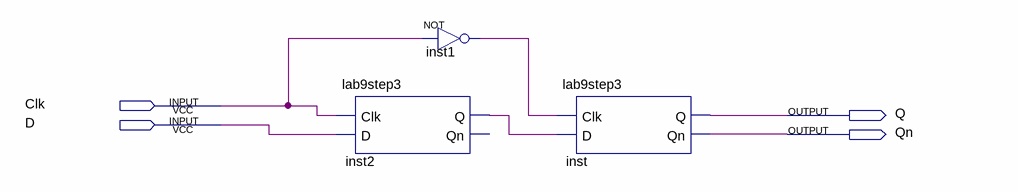
[diagram p0: schematic sheet]
// Quartus schematic lab9step3a.bdf as structural Verilog: 3 symbols, 4 pins
module lab9step3a (
  input  Clk,
  input  D,
  output Q,
  output Qn
);

  wire inst1_out, inst2_q;

  lab9step3 inst2 (.Clk(Clk), .D(D), .Q(inst2_q));  // open: Qn
  not inst1 (inst1_out, Clk);
  lab9step3 inst (.Clk(inst1_out), .D(inst2_q), .Q(Q), .Qn(Qn));
endmodule
